# Altium schematic sheet USB.SchDoc
size B; SheetNumber: 8; SheetTotal: 8
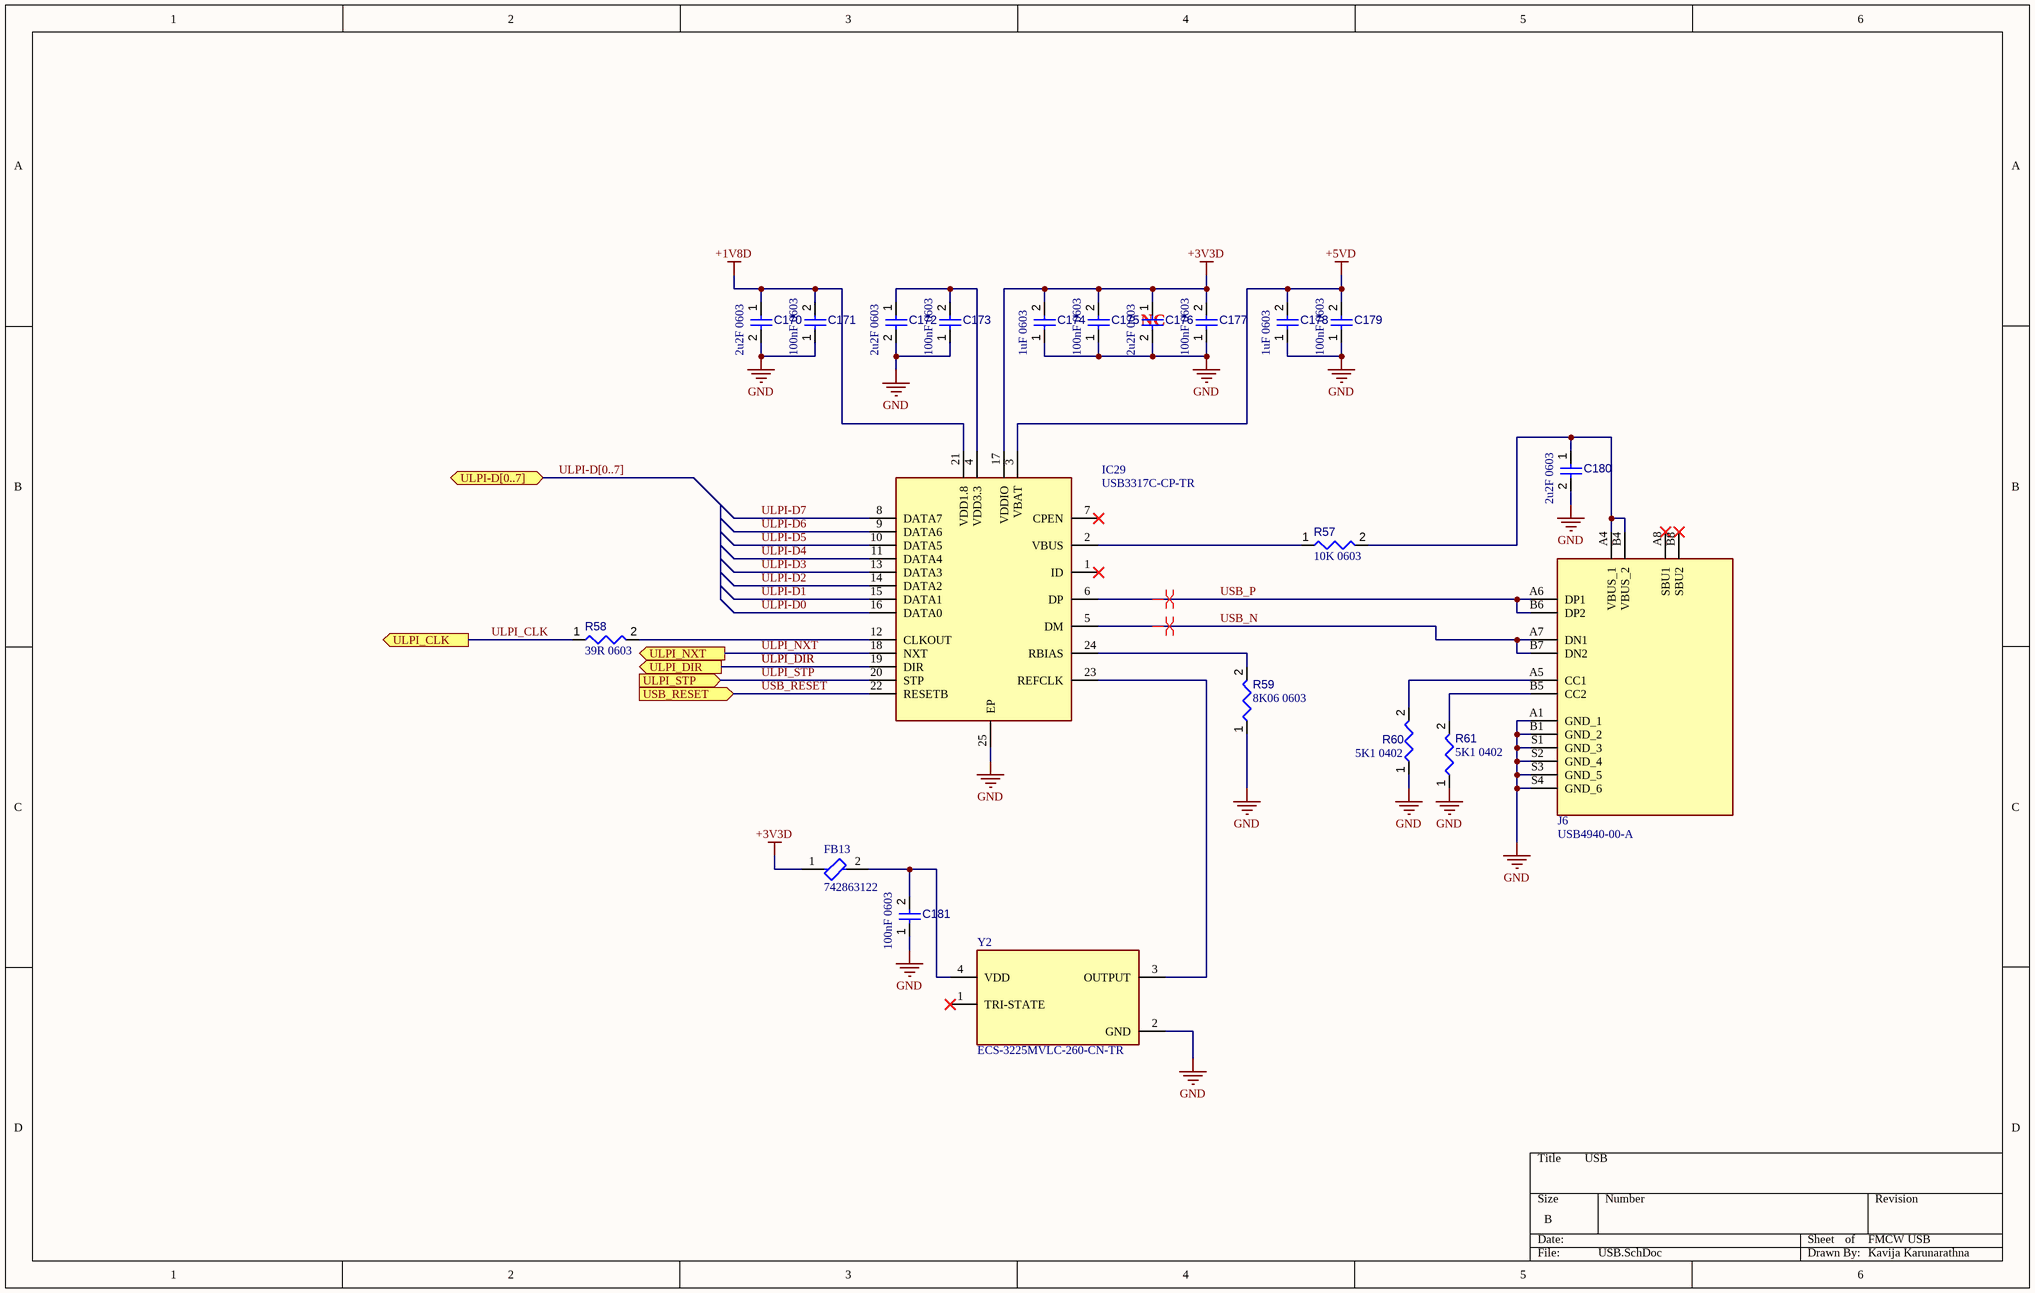
[diagram p0: USB.SchDoc]

## Parts
C170  value 2u2F 0603  [CAPC0603(1608)100_L]  (hidden comment: Capacitor 1µF +/-0.1% 25V 0603)
C171  value 100nF 0603  [CAPC0603(1608)100_L]  (hidden comment: Capacitor 1µF +/-0.1% 25V 0603)
C172  value 2u2F 0603  [CAPC0603(1608)100_L]  (hidden comment: Capacitor 1µF +/-0.1% 25V 0603)
C173  value 100nF 0603  [CAPC0603(1608)100_L]  (hidden comment: Capacitor 1µF +/-0.1% 25V 0603)
C174  value 1uF 0603  [CAPC0603(1608)100_L]  (hidden comment: Capacitor 1µF +/-0.1% 25V 0603)
C175  value 100nF 0603  [CAPC0603(1608)100_L]  (hidden comment: Capacitor 1µF +/-0.1% 25V 0603)
C176  value 2u2F 0603  [CAPC0603(1608)100_L]  (hidden comment: Capacitor 1µF +/-0.1% 25V 0603)
C177  value 100nF 0603  [CAPC0603(1608)100_L]  (hidden comment: Capacitor 1µF +/-0.1% 25V 0603)
C178  value 1uF 0603  [CAPC0603(1608)100_L]  (hidden comment: Capacitor 1µF +/-0.1% 25V 0603)
C179  value 100nF 0603  [CAPC0603(1608)100_L]  (hidden comment: Capacitor 1µF +/-0.1% 25V 0603)
C180  value 2u2F 0603  [CAPC0603(1608)100_L]  (hidden comment: Capacitor 1µF +/-0.1% 25V 0603)
C181  value 100nF 0603  [CAPC0603(1608)100_L]  (hidden comment: Capacitor 1µF +/-0.1% 25V 0603)
FB13  742863122  [FB-0603]
IC29  USB3317C-CP-TR  [QFN50P400X400X100-25N-D]
J6  USB4940-00-A  [USB494000A]
R57  value 10K 0603  [RESC0603(1608)_L]  (hidden comment: 120R3J)
R58  value 39R 0603  [RESC0603(1608)_L]  (hidden comment: 120R3J)
R59  value 8K06 0603  [RESC0603(1608)_L]  (hidden comment: 120R3J)
R60  value 5K1 0402  [RESC0402(1005)_L]  (hidden comment: 383KR2F)
R61  value 5K1 0402  [RESC0402(1005)_L]  (hidden comment: 383KR2F)
Y2  ECS-3225MVLC-260-CN-TR  [OSC_ECS-3225MVLC-260-CN-TR]

## Ports
ULPI-D[0..7] (bidir, see MCU[6A]), ULPI_CLK (out, see MCU[3D]), ULPI_DIR (out, see MCU[2B]), ULPI_NXT (out, see MCU[2C]), ULPI_STP (in, see MCU[2B]), USB_RESET (in, see MCU[4C])

## Nets
+1V8D: C170.1 C171.2 IC29.21(VDD1.8)
+3V3D: C174.2 C175.2 C176.1 C177.2 FB13.1 IC29.17(VDDIO)
+5VD: C178.2 C179.2 IC29.3(VBAT)
GND: C170.2 C171.1 C172.2 C173.1 C174.1 C175.1 C176.2 C177.1 C178.1 C179.1 C180.2 C181.1 IC29.25(EP) J6.A1(GND_1) J6.B1(GND_2) J6.S1(GND_3) J6.S2(GND_4) J6.S3(GND_5) J6.S4(GND_6) R59.1 R60.1 R61.1 Y2.2(GND)
ULPI-D0: IC29.16(DATA0)
ULPI-D1: IC29.15(DATA1)
ULPI-D2: IC29.14(DATA2)
ULPI-D3: IC29.13(DATA3)
ULPI-D4: IC29.11(DATA4)
ULPI-D5: IC29.10(DATA5)
ULPI-D6: IC29.9(DATA6)
ULPI-D7: IC29.8(DATA7)
ULPI_CLK: R58.1 ; port ULPI_CLK
ULPI_DIR: IC29.19(DIR) ; port ULPI_DIR
ULPI_NXT: IC29.18(NXT) ; port ULPI_NXT
ULPI_STP: IC29.20(STP) ; port ULPI_STP
USB_N: IC29.5(DM) J6.A7(DN1) J6.B7(DN2)
USB_P: IC29.6(DP) J6.A6(DP1) J6.B6(DP2)
USB_RESET: IC29.22(RESETB) ; port USB_RESET
NetC172_1: C172.1 C173.2 IC29.4(VDD3.3)
NetC180_1: C180.1 J6.A4(VBUS_1) J6.B4(VBUS_2) R57.2
NetC181_2: C181.2 FB13.2 Y2.4(VDD)
NetIC29_2: IC29.2(VBUS) R57.1
NetIC29_12: IC29.12(CLKOUT) R58.2
NetIC29_23: IC29.23(REFCLK) Y2.3(OUTPUT)
NetIC29_24: IC29.24(RBIAS) R59.2
NetJ6_A5: J6.A5(CC1) R60.2
NetJ6_B5: J6.B5(CC2) R61.2

Not connected (* = marked no-connect by the designer): IC29 1(ID)* 7(CPEN)*; J6 A8(SBU1)* B8(SBU2)*; Y2 1(TRI-STATE)*

## Buses and harness runs
bus ULPI-D[0..7] = port ULPI-D[0..7]

## Layout directives
differential pair: USB_N, USB_P

## Notes on the sheet
- (near C176) NC
- USB
- FMCW USB
- Kavija Karunarathna

## Library data of the parts
C170 C172 C176 C180 = CMP-001-00055-4: Multilayer Ceramic Capacitors MLCC - SMD/SMT 0603 10nF 16volts X7R 10%; Manufacturer Part No: VJ0603G225KXQCW1BC; Tolerance: 20%; Min Operating Temperature: -55°C; Max Operating Temperature: 85°C; Voltage Rating: 25V; Mounting Technology: SMT; Case/Package: 0603; Pins: 2; Mouser Part No: 77-VJ0603G225KXQCWBC
C171 C173 C175 C177 C179 C181 = CMP-001-00055-4: Chip Capacitor, 1µF +/-0.1%, 25V, 0603, Thickness 1 mm; Manufacturer Part No: 0603X104K250CT; Tolerance: 20%; Min Operating Temperature: -55°C; Max Operating Temperature: 85°C; Voltage Rating: 25V; Mounting Technology: SMT; Case/Package: 0603; Pins: 2; Mouser Part No: 791-0603X104K250CT
C174 C178 = CMP-001-00055-4: Chip Capacitor, 1µF +/-0.1%, 25V, 0603, Thickness 1 mm; Manufacturer Part No: 0603YC105KAZ2A; Tolerance: 20%; Min Operating Temperature: -55°C; Max Operating Temperature: 85°C; Voltage Rating: 25V; Mounting Technology: SMT; Case/Package: 0603; Pins: 2; Mouser Part No: 581-0603YC105KAZ2A
FB13 = 742792662-FB: FERRITE BEAD 0603; Max Current Rating: 600mA; DC Resistance (DCR): 1000Ohm; Number of Lines: 1; Case/Package: 0603; Mount: Surface Mount; Case Code (Imperial): 0603; Packaging: Cut Tape; Max Operating Temperature: 125°C; Min Operating Temperature: -55°C; Manufacturer Part No: 742863122; Mouser Part No: 710-742863122
IC29 = USB3317C-CP-TR: Integrated Circuit; Manufacturer_Name: Microchip; Datasheet Link: http://www.microchip.com/mymicrochip/filehandler.aspx?ddocname=en562028; Height: 1mm; Manufacturer Part No: USB3317C-CP-TR; Mouser Part No: 886-USB3317C-CP-TR; Mouser Price/Stock: https://www.mouser.co.uk/ProductDetail/Microchip-Technology/USB3317C-CP-TR?qs=pA5MXup5wxGaIwrlfVA7Qw%3D%3D; Arrow Part Number: USB3317C-CP-TR; Arrow Price/Stock: https://www.arrow.com/en/products/usb3317c-cp-tr/microchip-technology?region=nac
J6 = USB4940-00-A: USB Connectors USB Type C, 2.0, 16P, Receptacle, Horizontal, Top Mount, SMT,T&R; Manufacturer_Name: GCT (GLOBAL CONNECTOR TECHNOLOGY); Datasheet Link: https://gct.co/download?type=PDFDrawing&name=USB4940.pdf; Height: 3.46mm; Manufacturer Part No: USB4940-00-A; Mouser Part No: 640-USB4940-00-A
R57 = CMP-009-00069-2: Thin Film Resistors - SMD CHIP RESISTOR Precision; Manufacturer Part No: CRT0603-FY-1002ELF; Power: 100mW; Tolerance: 5%; Mounting Technology: SMT; Case/Package: 0603; Pins: 2; Mouser Part No: 652-CRT0603FY1002ELF
R58 = CMP-009-00069-2: Thick Film Resistors - SMD 1/10Watt 39ohms 1% Commercial Use; Manufacturer Part No: CRCW060339R0FKEAC; Power: 100mW; Tolerance: 5%; Mounting Technology: SMT; Case/Package: 0603; Pins: 2; Mouser Part No: 71-CRCW060339R0FKEAC
R59 = CMP-009-00069-2: Thin Film Resistors - SMD RN 0603 8K06 0.1% 10PPM; Manufacturer Part No: RN73C1J8K06BTDF; Power: 100mW; Tolerance: 5%; Mounting Technology: SMT; Case/Package: 0603; Pins: 2; Mouser Part No: 279-RN73C1J8K06BTDF
R60 R61 = CMP-009-00097-2: Thick Film Resistors - SMD 1/10 Watt 5.1Kohms 1%; Manufacturer Part No: CRCW04025K10FKED; Power: 100mW; Tolerance: 1%; Case/Package: 0402; Mounting Technology: SMT; Pins: 2; Mouser Part No: 71-CRCW0402-5.1K-E3
Y2 = CMP-299-000000-2: 26 MHz XO (Standard) CMOS Oscillator 1.8V ~ 3.3V Enable/Disable 4-SMD, No Lead; MF: ECS Inc.; Package: ECS-3225MVLC-0-4 ECS; Value: *; Check_prices: https://www.snapeda.com/parts/ECS-3225MVLC-260-CN-TR/ECS/view-part/?ref=eda; Pin Count: 4; ComponentLink1Description: Datasheet; Design Item ID: ECS-3225MVLC-260-CN-TR; Component Type: Standard; SnapEDA_Link: https://www.snapeda.com/parts/ECS-3225MVLC-260-CN-TR/ECS/view-part/?ref=snap; ComponentLink2Description: DigiKey Link; Source: ECS-3225MVLC-260-CN-TR.SchLib; MP: ECS-3225MVLC-260-CN-TR